# Altium schematic sheet OSCILLAR_HFB_V1p0_DRV.SchDoc
size A4; SheetNumber: 13; SheetTotal: 13; Title_: Output Driver
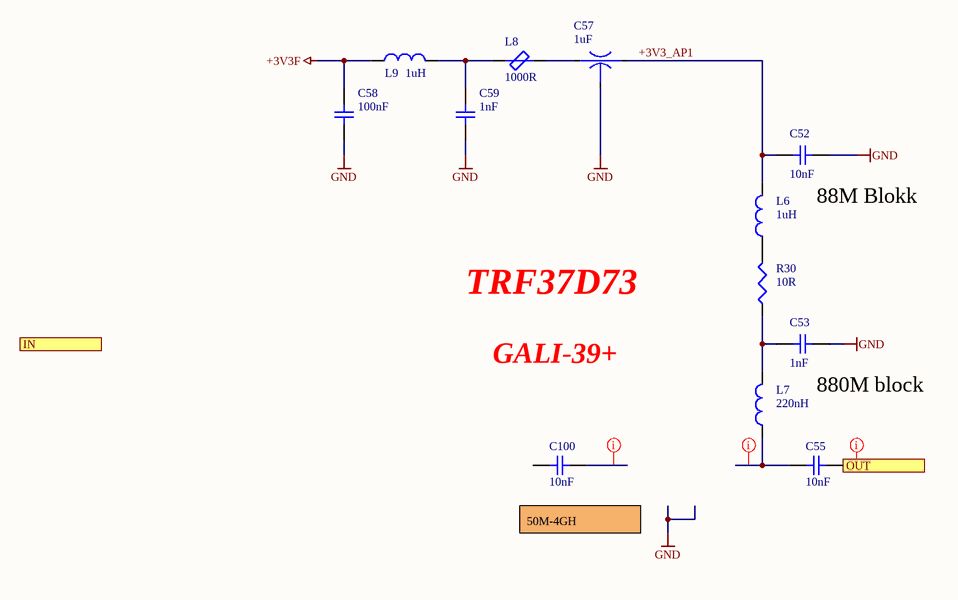
[diagram p0: OSCILLAR_HFB_V1p0_DRV.SchDoc]

## Parts
C52  10nF  [CAP-0805]
C53  1nF  [CAP-0805]
C55  10nF  [CAP_0603]
C57  1uF  [CAP-0805-EMI]
C58  100nF  [CAP-0805]
C59  1nF  [CAP-0805]
C100  10nF  [CAP_0603]
L6  1uH  [IND-0805]
L7  220nH  [IND-0805]
L8  1000R  [IND-0805-EMI]
L9  1uH  [IND-0805-EMI]
R30  10R  [RES-0805]

## Ports
IN (in, see OSCILLAR_HFB_V1p0_MAIN), OUT (out, see OSCILLAR_HFB_V1p0_MAIN)

## Nets
+3V3F: C58.1 L9.1
GND: C52.2 C53.2 C57.2 C58.2 C59.2
+3V3_AP1: C52.1 C57.1 L6.2
OUT: C55.1 ; port OUT
NetC53_1: C53.1 L7.2 R30.1
NetC55_2: C55.2 L7.1
NetC57_3: C57.3 L8.2
NetC59_1: C59.1 L8.1 L9.2
NetL6_1: L6.1 R30.2

Not connected (* = marked no-connect by the designer): C100 1 2

## Layout directives
net class 50R: (no net found under the mark), NetC55_2, NetC100_1

## Notes on the sheet
- (near C52) 88M Blokk
- TRF37D73
- GALI-39+
- (near C53) 880M block
- (near C100) 50M-4GH
- Board:
- Author:
- Title:
- Project:
- SVN:
- Version:
- Sheet:
- of
- Contact:
- Modified:
- Size:
- A4

## Library data of the parts
C52 C53 C55 C58 C59 C100 = NP-CAPACITOR: MLCC capacitor; Type: CAP
C57 = EMI_CAPACITOR: EMI filter capacitor; Type: CAP
L6 L7 L9 = AC-INDUCTOR: Air core coil; Type: IND
L8 = BLM21SP102SN1D: Chip Ferrite Bead, 1000R @100MHz, 1.6A; Part number: 81-BLM21SP102SN1D; Type: IND; Supplier: Mouser; ComponentLink1Description: Datasheet; ComponentLink1URL: ENFA0005-1915781.pdf; ComponentLink2Description: Order; ComponentLink2URL: https://hu.mouser.com/ProductDetail/Murata-Electronics/BLM21SP102SN1D?qs=17u8i%2FzlE88oj6hmj%252BXptA%3D%3D
R30 = RESISTOR: Metal Film Resistor; Type: RES